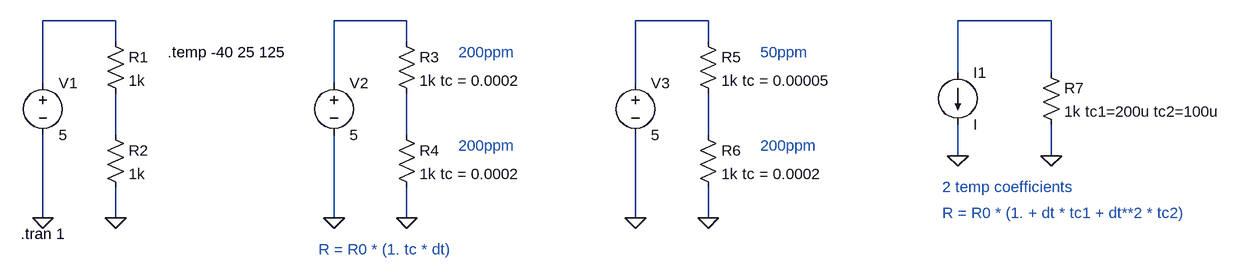
[diagram p0: schematic Draft1.asc]
Draft1.asc, the LTspice schematic file:
Version 4
SHEET 1 1936 680
WIRE 176 16 64 16
WIRE 624 16 512 16
WIRE 1088 16 976 16
WIRE 1616 16 1472 16
WIRE 176 48 176 16
WIRE 624 48 624 16
WIRE 1088 48 1088 16
WIRE 1472 96 1472 16
WIRE 1616 96 1616 16
WIRE 64 112 64 16
WIRE 512 112 512 16
WIRE 976 112 976 16
WIRE 176 192 176 128
WIRE 624 192 624 128
WIRE 1088 192 1088 128
WIRE 1472 224 1472 176
WIRE 1616 224 1616 176
WIRE 64 320 64 192
WIRE 176 320 176 272
WIRE 512 320 512 192
WIRE 624 320 624 272
WIRE 976 320 976 192
WIRE 1088 320 1088 272
FLAG 64 320 0
FLAG 176 320 0
FLAG 512 320 0
FLAG 624 320 0
FLAG 976 320 0
FLAG 1088 320 0
FLAG 1472 224 0
FLAG 1616 224 0
SYMBOL voltage 64 96 R0
WINDOW 123 0 0 Left 0
WINDOW 39 0 0 Left 0
SYMATTR InstName V1
SYMATTR Value 5
SYMBOL res 160 32 R0
SYMATTR InstName R1
SYMATTR Value 1k
SYMBOL res 160 176 R0
SYMATTR InstName R2
SYMATTR Value 1k
SYMBOL voltage 512 96 R0
WINDOW 123 0 0 Left 0
WINDOW 39 0 0 Left 0
SYMATTR InstName V2
SYMATTR Value 5
SYMBOL res 608 32 R0
SYMATTR InstName R3
SYMATTR Value 1k tc = 0.0002
SYMBOL res 608 176 R0
SYMATTR InstName R4
SYMATTR Value 1k tc = 0.0002
SYMBOL voltage 976 96 R0
WINDOW 123 0 0 Left 0
WINDOW 39 0 0 Left 0
SYMATTR InstName V3
SYMATTR Value 5
SYMBOL res 1072 32 R0
SYMATTR InstName R5
SYMATTR Value 1k tc = 0.00005
SYMBOL res 1072 176 R0
SYMATTR InstName R6
SYMATTR Value 1k tc = 0.0002
SYMBOL current 1472 96 R0
SYMATTR InstName I1
SYMBOL res 1600 80 R0
SYMATTR InstName R7
SYMATTR Value 1k tc1=200u tc2=100u
TEXT 256 64 Left 2 !.temp -40 25 125
TEXT 30 344 Left 2 !.tran 1
TEXT 704 64 Left 2 ;200ppm
TEXT 704 208 Left 2 ;200ppm
TEXT 488 368 Left 2 ;R = R0 * (1. tc * dt)
TEXT 1168 64 Left 2 ;50ppm
TEXT 1168 208 Left 2 ;200ppm
TEXT 1448 272 Left 2 ;2 temp coefficients
TEXT 1448 312 Left 2 ;R = R0 * (1. + dt * tc1 + dt**2 * tc2)

The netlist it stands for:
* Draft1.asc
V1 N001 0 5
R1 N001 N005 1k
R2 N005 0 1k
V2 N002 0 5
R3 N002 N006 1k tc = 0.0002
R4 N006 0 1k tc = 0.0002
V3 N003 0 5
R5 N003 N007 1k tc = 0.00005
R6 N007 0 1k tc = 0.0002
I1 N004 0 I
R7 N004 0 1k tc1=200u tc2=100u
.temp -40 25 125
.tran 1
* 200ppm
* 200ppm
* R = R0 * (1. tc * dt)
* 50ppm
* 200ppm
* 2 temp coefficients
* R = R0 * (1. + dt * tc1 + dt**2 * tc2)
.backanno
.end